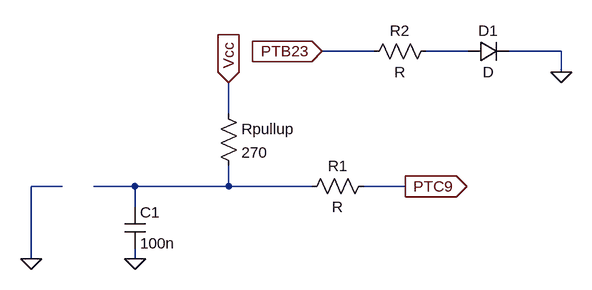
[diagram p0: schematic Draft3.asc]
Draft3.asc, the LTspice schematic file:
Version 4
SHEET 1 880 680
WIRE 352 -64 272 -64
WIRE 496 -64 432 -64
WIRE 640 -64 560 -64
WIRE 640 -32 640 -64
WIRE 128 32 128 -16
WIRE -128 144 -176 144
WIRE -16 144 -80 144
WIRE 128 144 128 112
WIRE 128 144 -16 144
WIRE 256 144 128 144
WIRE 400 144 336 144
WIRE -16 176 -16 144
WIRE -176 256 -176 144
WIRE -16 256 -16 240
FLAG 128 -16 Vcc
IOPIN 128 -16 In
FLAG -176 256 0
FLAG -16 256 0
FLAG 400 144 PTC9
IOPIN 400 144 Out
FLAG 640 -32 0
FLAG 272 -64 PTB23
IOPIN 272 -64 In
SYMBOL res 112 16 R0
SYMATTR InstName Rpullup
SYMATTR Value 270
SYMBOL cap -32 176 R0
SYMATTR InstName C1
SYMATTR Value 100n
SYMBOL res 352 128 R90
WINDOW 0 0 56 VBottom 2
WINDOW 3 32 56 VTop 2
SYMATTR InstName R1
SYMBOL res 448 -80 R90
WINDOW 0 0 56 VBottom 2
WINDOW 3 32 56 VTop 2
SYMATTR InstName R2
SYMBOL diode 496 -48 R270
WINDOW 0 32 32 VTop 2
WINDOW 3 0 32 VBottom 2
SYMATTR InstName D1

The netlist it stands for:
* Draft3.asc
Rpullup Vcc N002 270
C1 N002 0 100n
R1 PTC9 N002 R
R2 N001 PTB23 R
D1 N001 0 D
.model D D
.lib standard.dio
.backanno
.end